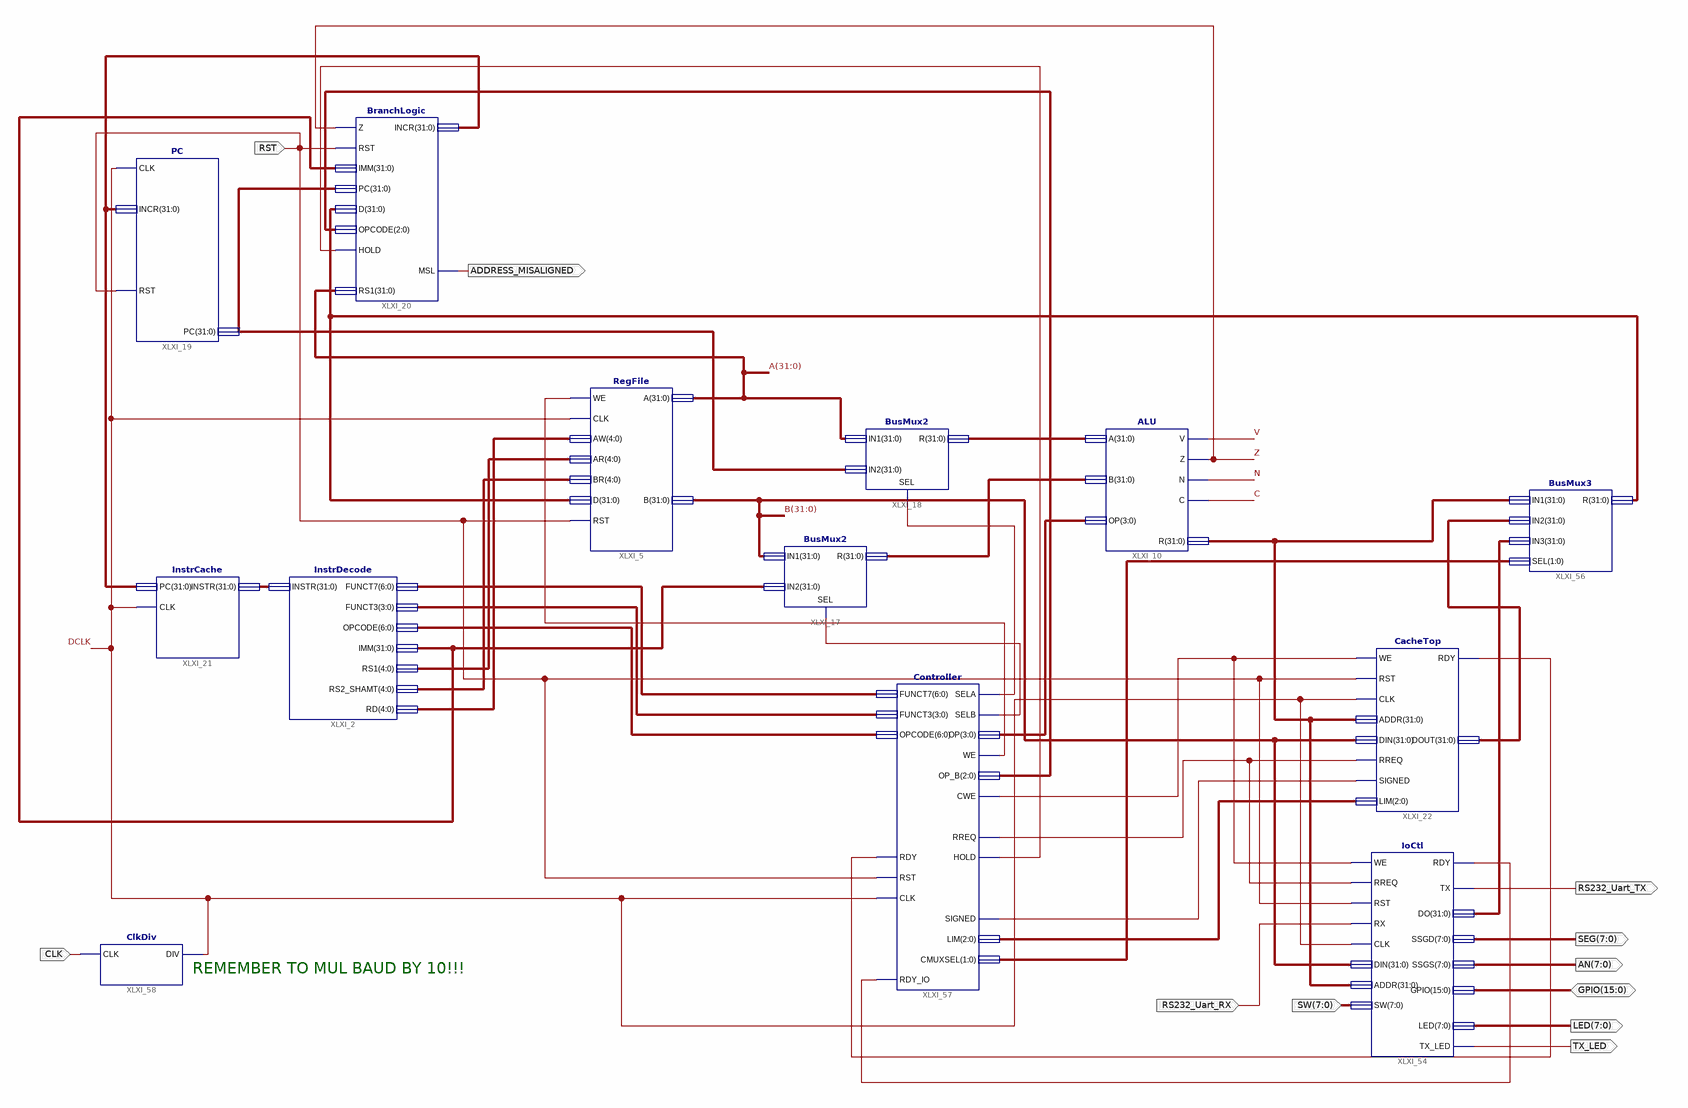
[diagram p0: schematic sheet 1]
// Xilinx ISE schematic top.sch (spartan6) as structural Verilog: 13 symbols, 11 ports
module top (
  input  RST,
  input  RS232_Uart_RX,
  input  [7:0] SW,
  input  CLK,
  inout  [15:0] GPIO,
  output ADDRESS_MISALIGNED,
  output RS232_Uart_TX,
  output [7:0] LED,
  output [7:0] SEG,
  output [7:0] AN,
  output TX_LED
);

  wire C, DCLK, N, V, XLXN_64, XLXN_65, XLXN_261, XLXN_269, XLXN_271, XLXN_320, XLXN_321, XLXN_327, XLXN_328,
       Z;
  wire [1:0] XLXN_326;
  wire [2:0] XLXN_266, XLXN_272;
  wire [3:0] XLXN_12, XLXN_26;
  wire [4:0] XLXN_257, XLXN_258, XLXN_259;
  wire [6:0] XLXN_25, XLXN_27;
  wire [31:0] A, B, XLXN_9, XLXN_42, XLXN_108, XLXN_118, XLXN_232, XLXN_233, XLXN_243, XLXN_245, XLXN_263,
       XLXN_319;

  IoCtl XLXI_54 (
    .WE(XLXN_320), .RREQ(XLXN_321), .RST(RST), .RX(RS232_Uart_RX), .CLK(DCLK), .DIN(B), .ADDR(XLXN_232),
    .SW(SW), .GPIO(GPIO), .RDY(XLXN_327), .TX(RS232_Uart_TX), .TX_LED(TX_LED), .DO(XLXN_319), .SSGD(SEG),
    .SSGS(AN), .LED(LED));
  RegFile XLXI_5 (
    .WE(XLXN_261), .CLK(DCLK), .RST(RST), .AW(XLXN_257), .AR(XLXN_259), .BR(XLXN_258), .D(XLXN_263), .A(A),
    .B(B));
  ALU XLXI_10 (.A(XLXN_9), .B(XLXN_42), .OP(XLXN_12), .V(V), .Z(Z), .N(N), .C(C), .R(XLXN_232));
  BusMux2 XLXI_18 (.SEL(XLXN_65), .IN1(A), .IN2(XLXN_245), .R(XLXN_9));
  PC XLXI_19 (.CLK(DCLK), .RST(RST), .INCR(XLXN_243), .PC(XLXN_245));
  InstrDecode XLXI_2 (
    .INSTR(XLXN_108), .FUNCT7(XLXN_25), .FUNCT3(XLXN_26), .OPCODE(XLXN_27), .IMM(XLXN_118), .RS1(XLXN_259),
    .RS2_SHAMT(XLXN_258), .RD(XLXN_257));
  InstrCache XLXI_21 (.CLK(DCLK), .PC(XLXN_243), .INSTR(XLXN_108));
  CacheTop XLXI_22 (
    .WE(XLXN_320), .RREQ(XLXN_321), .SIGNED(XLXN_271), .RST(RST), .CLK(DCLK), .ADDR(XLXN_232), .DIN(B),
    .LIM(XLXN_272), .RDY(XLXN_328), .DOUT(XLXN_233));
  BranchLogic XLXI_20 (
    .HOLD(XLXN_269), .Z(Z), .RST(RST), .IMM(XLXN_118), .RS1(A), .PC(XLXN_245), .D(XLXN_263),
    .OPCODE(XLXN_266), .MSL(ADDRESS_MISALIGNED), .INCR(XLXN_243));
  BusMux3 XLXI_56 (.IN1(XLXN_232), .IN2(XLXN_233), .IN3(XLXN_319), .SEL(XLXN_326), .R(XLXN_263));
  Controller XLXI_57 (
    .RDY(XLXN_328), .RST(RST), .CLK(DCLK), .FUNCT7(XLXN_25), .FUNCT3(XLXN_26), .OPCODE(XLXN_27),
    .HOLD(XLXN_269), .SELA(XLXN_65), .SELB(XLXN_64), .WE(XLXN_261), .CWE(XLXN_320), .RREQ(XLXN_321),
    .SIGNED(XLXN_271), .LIM(XLXN_272), .CMUXSEL(XLXN_326), .OP(XLXN_12), .OP_B(XLXN_266), .RDY_IO(XLXN_327));
  BusMux2 XLXI_17 (.SEL(XLXN_64), .IN1(B), .IN2(XLXN_118), .R(XLXN_42));
  ClkDiv XLXI_58 (.CLK(CLK), .DIV(DCLK));

  // Notes on the sheet:
  //   REMEMBER TO MUL BAUD BY 10!!!
endmodule
